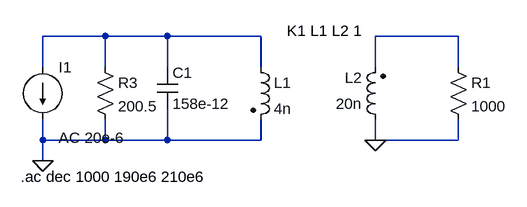
[diagram p0: schematic Ej2_EA3.asc]
Ej2_EA3.asc, the LTspice schematic file:
Version 4
SHEET 1 880 680
WIRE 0 64 -96 64
WIRE 96 64 0 64
WIRE 240 64 96 64
WIRE 544 64 416 64
WIRE -96 112 -96 64
WIRE 0 112 0 64
WIRE 96 112 96 64
WIRE 240 112 240 64
WIRE 416 112 416 64
WIRE 544 112 544 64
WIRE -96 224 -96 192
WIRE 0 224 0 192
WIRE 0 224 -96 224
WIRE 96 224 96 176
WIRE 96 224 0 224
WIRE 240 224 240 192
WIRE 240 224 96 224
WIRE 416 224 416 192
WIRE 544 224 544 192
WIRE 544 224 416 224
WIRE -96 256 -96 224
FLAG -96 256 0
FLAG 416 224 0
SYMBOL ind2 224 96 R0
SYMATTR InstName L1
SYMATTR Value 4n
SYMATTR Type ind
SYMBOL cap 80 112 R0
SYMATTR InstName C1
SYMATTR Value 158e-12
SYMBOL res 528 96 R0
SYMATTR InstName R1
SYMATTR Value 1000
SYMBOL res -16 96 R0
SYMATTR InstName R3
SYMATTR Value 200.5
SYMBOL current -96 112 R0
WINDOW 3 24 136 Left 2
WINDOW 123 24 108 Left 2
WINDOW 39 0 0 Left 0
SYMATTR InstName I1
SYMATTR Value ""
SYMATTR Value2 AC 20e-6
SYMBOL ind2 432 208 R180
WINDOW 0 36 80 Left 2
WINDOW 3 36 40 Left 2
SYMATTR InstName L2
SYMATTR Value 20n
SYMATTR Type ind
TEXT -130 280 Left 2 !.ac dec 1000 190e6 210e6
TEXT 280 56 Left 2 !K1 L1 L2 1

The netlist it stands for:
* Ej2_EA3.asc
L1 N001 0 4n
C1 N001 0 158e-12
R1 N002 0 1000
R3 N001 0 200.5
I1 N001 0 AC 20e-6
L2 0 N002 20n
.ac dec 1000 190e6 210e6
K1 L1 L2 1
.backanno
.end